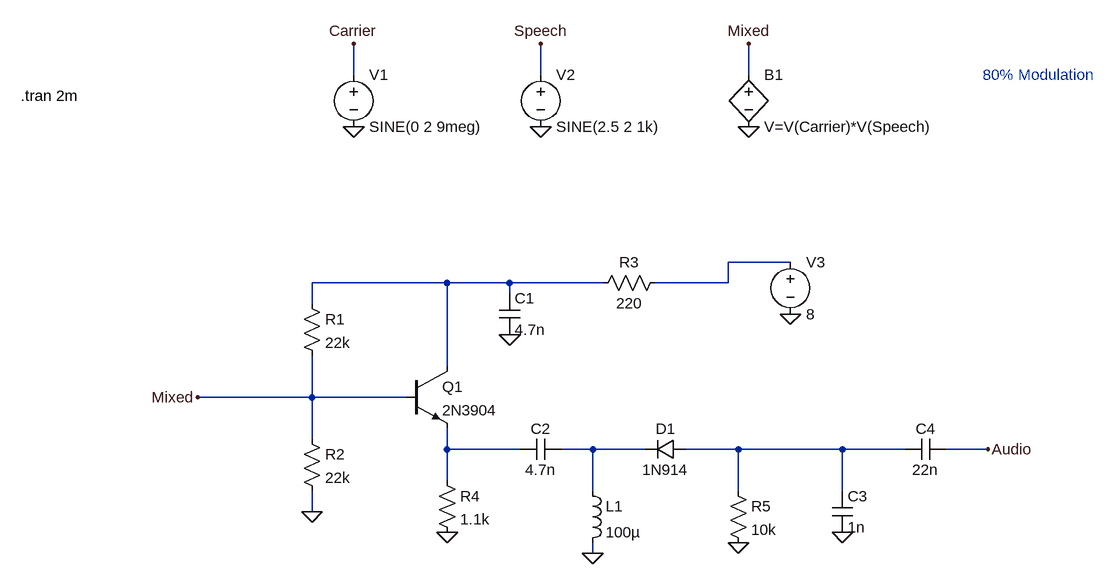
[diagram p0: schematic AM_Demodulation.asc]
AM_Demodulation.asc, the LTspice schematic file:
Version 4
SHEET 1 2036 1136
WIRE -144 144 -144 96
WIRE 144 144 144 96
WIRE 464 144 464 96
WIRE 528 432 432 432
WIRE 0 464 -208 464
WIRE 96 464 0 464
WIRE 240 464 96 464
WIRE 432 464 432 432
WIRE 432 464 320 464
WIRE 96 480 96 464
WIRE -208 496 -208 464
WIRE 0 592 0 464
WIRE -208 640 -208 576
WIRE -208 640 -384 640
WIRE -64 640 -208 640
WIRE -208 704 -208 640
WIRE 0 720 0 688
WIRE 112 720 0 720
WIRE 224 720 176 720
WIRE 304 720 224 720
WIRE 448 720 368 720
WIRE 608 720 448 720
WIRE 704 720 608 720
WIRE 832 720 768 720
WIRE 0 768 0 720
WIRE 224 784 224 720
WIRE 448 784 448 720
WIRE 608 784 608 720
WIRE -208 816 -208 784
WIRE 224 880 224 864
FLAG -144 224 0
FLAG 144 224 0
FLAG 464 224 0
FLAG -144 96 Carrier
FLAG 144 96 Speech
FLAG 464 96 Mixed
FLAG -208 816 0
FLAG 96 544 0
FLAG 528 512 0
FLAG 224 880 0
FLAG 0 848 0
FLAG 448 864 0
FLAG 608 848 0
FLAG 832 720 Audio
FLAG -384 640 Mixed
SYMBOL voltage -144 128 R0
WINDOW 123 0 0 Left 0
WINDOW 39 0 0 Left 0
SYMATTR InstName V1
SYMATTR Value SINE(0 2 9meg)
SYMBOL voltage 144 128 R0
WINDOW 123 0 0 Left 0
WINDOW 39 0 0 Left 0
SYMATTR InstName V2
SYMATTR Value SINE(2.5 2 1k)
SYMBOL bv 464 128 R0
SYMATTR InstName B1
SYMATTR Value V=V(Carrier)*V(Speech)
SYMBOL res -224 480 R0
SYMATTR InstName R1
SYMATTR Value 22k
SYMBOL res -224 688 R0
SYMATTR InstName R2
SYMATTR Value 22k
SYMBOL npn -64 592 R0
SYMATTR InstName Q1
SYMATTR Value 2N3904
SYMBOL cap 80 480 R0
SYMATTR InstName C1
SYMATTR Value 4.7n
SYMBOL res 336 448 R90
WINDOW 0 0 56 VBottom 2
WINDOW 3 32 56 VTop 2
SYMATTR InstName R3
SYMATTR Value 220
SYMBOL voltage 528 416 R0
WINDOW 123 0 0 Left 0
WINDOW 39 0 0 Left 0
SYMATTR InstName V3
SYMATTR Value 8
SYMBOL cap 176 704 R90
WINDOW 0 0 32 VBottom 2
WINDOW 3 32 32 VTop 2
SYMATTR InstName C2
SYMATTR Value 4.7n
SYMBOL ind 208 768 R0
SYMATTR InstName L1
SYMATTR Value 100µ
SYMBOL res -16 752 R0
SYMATTR InstName R4
SYMATTR Value 1.1k
SYMBOL diode 368 704 R90
WINDOW 0 0 32 VBottom 2
WINDOW 3 32 32 VTop 2
SYMATTR InstName D1
SYMATTR Value 1N914
SYMBOL res 432 768 R0
SYMATTR InstName R5
SYMATTR Value 10k
SYMBOL cap 592 784 R0
SYMATTR InstName C3
SYMATTR Value 1n
SYMBOL cap 768 704 R90
WINDOW 0 0 32 VBottom 2
WINDOW 3 32 32 VTop 2
SYMATTR InstName C4
SYMATTR Value 22n
TEXT -656 176 Left 2 !.tran 2m
TEXT 824 144 Left 2 ;80% Modulation

The netlist it stands for:
* AM_Demodulation.asc
V1 Carrier 0 SINE(0 2 9meg)
V2 Speech 0 SINE(2.5 2 1k)
B1 Mixed 0 V=V(Carrier)*V(Speech)
R1 N002 Mixed 22k
R2 Mixed 0 22k
Q1 N002 Mixed N003 0 2N3904
C1 N002 0 4.7n
R3 N001 N002 220
V3 N001 0 8
C2 N004 N003 4.7n
L1 N004 0 100µ
R4 N003 0 1.1k
D1 N005 N004 1N914
R5 N005 0 10k
C3 N005 0 1n
C4 Audio N005 22n
.model D D
.lib standard.dio
.model NPN NPN
.model PNP PNP
.lib standard.bjt
.tran 2m
* 80% Modulation
.backanno
.end